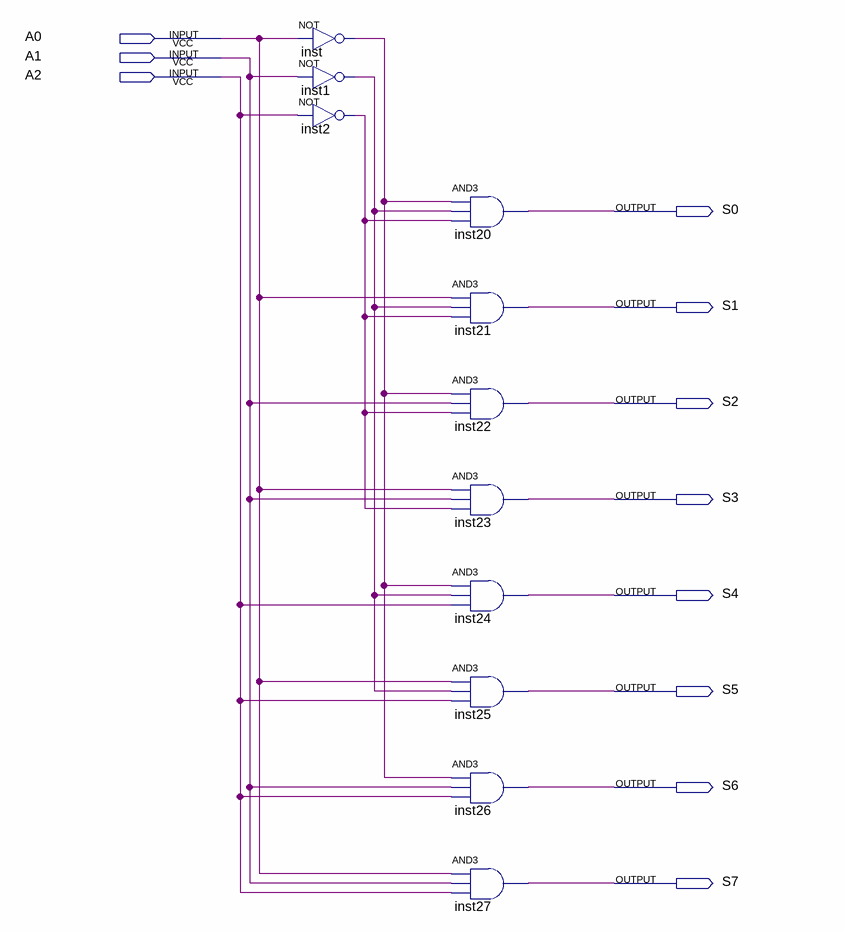
[diagram p0: schematic sheet]
// Quartus schematic DECOD_3X8.bdf as structural Verilog: 11 symbols, 11 pins
module DECOD_3X8 (
  input  A0,
  input  A1,
  input  A2,
  output S0,
  output S1,
  output S2,
  output S3,
  output S4,
  output S5,
  output S6,
  output S7
);

  wire inst1_out, inst2_out, inst_out;

  not inst (inst_out, A0);
  not inst1 (inst1_out, A1);
  not inst2 (inst2_out, A2);
  and inst20 (S0, inst_out, inst1_out, inst2_out);
  and inst21 (S1, A0, inst1_out, inst2_out);
  and inst22 (S2, inst_out, A1, inst2_out);
  and inst23 (S3, A0, A1, inst2_out);
  and inst24 (S4, inst_out, inst1_out, A2);
  and inst25 (S5, A0, inst1_out, A2);
  and inst26 (S6, inst_out, A1, A2);
  and inst27 (S7, A0, A1, A2);
endmodule
